# Altium schematic sheet RadioPCB.SchDoc
size A
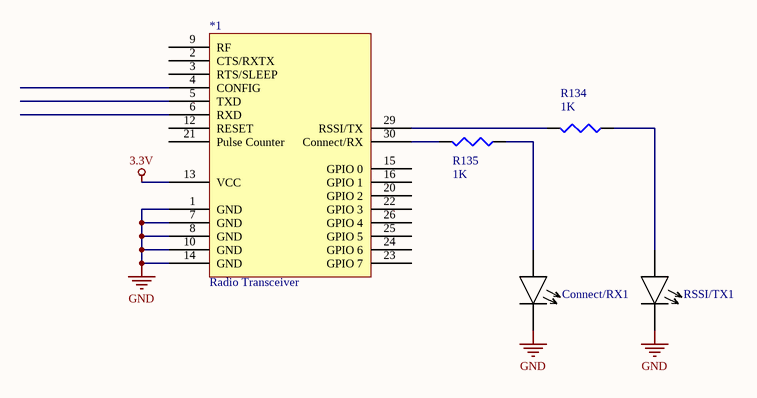
[diagram p0: RadioPCB.SchDoc]

## Parts
*1  Radio Transceiver  [Radio Transiever]
Connect/RX1  LED_B  [0402 footprint]  (value not drawn)
R134  value 1K  (hidden comment: Res3)
R135  value 1K  (hidden comment: Res3)
RSSI/TX1  LED_B  [0402 footprint]  (value not drawn)

## Nets
3.3V: *1.13(VCC)
GND: *1.1(GND) *1.7(GND) *1.8(GND) *1.10(GND) *1.14(GND) Connect/RX1.2 RSSI/TX1.2
Net*1_29: *1.29(RSSI/TX) R134.2
Net*1_30: *1.30(Connect/RX) R135.2
NetConnect/RX1_1: Connect/RX1.1 R135.1
NetR134_1: R134.1 RSSI/TX1.1

Not connected (* = marked no-connect by the designer): *1 2(CTS/RXTX) 3(RTS/SLEEP) 4(CONFIG) 5(TXD) 6(RXD) 9(RF) 12(RESET) 15(GPIO_0) 16(GPIO_1) 20(GPIO_2) 21(Pulse_Counter) 22(GPIO_3) 23(GPIO_7) 24(GPIO_6) 25(GPIO_5) 26(GPIO_4)

## Library data of the parts
R134 R135 = Res3: Resistor; Published: 8-Jun-2000; LatestRevisionDate: 29-May-2009; LatestRevisionNote: IPC-7351 Footprint Added.; PackageReference: J1-0603; Publisher: Altium Limited; PackageDescription: Chip Resistor
*1 = Radio Transceiver: Supplier 1: Digi-Key; Supplier Part Number 1: 1783-1044-1-ND
Connect/RX1 RSSI/TX1 = LED_B: Supplier 1: Digi-Key; Supplier Part Number 1: 754-2122-1-ND